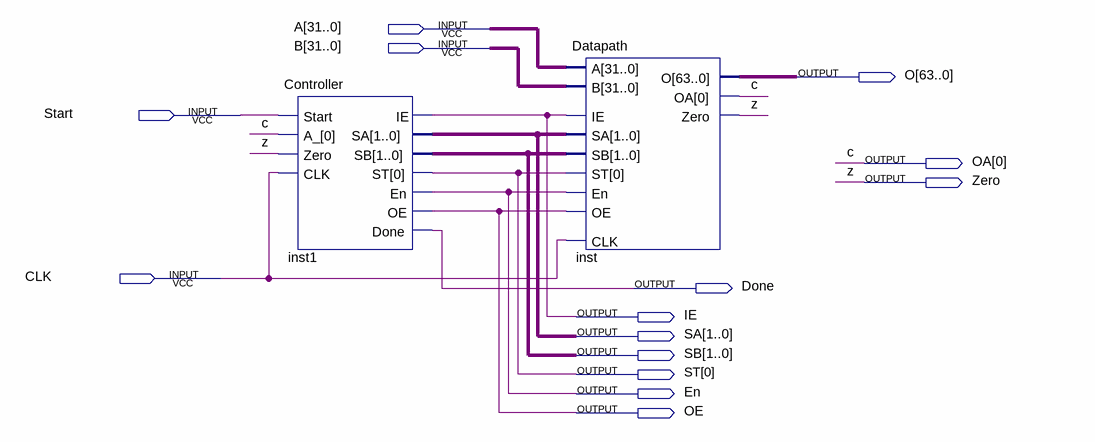
[diagram p0: schematic sheet]
// Quartus schematic VXL.bdf as structural Verilog: 2 symbols, 14 pins
module VXL (
  input  [31:0] A,
  input  [31:0] B,
  input  Start,
  input  CLK,
  output [63:0] O,
  output [0:0] OA,
  output Zero,
  output Done,
  output IE,
  output [1:0] SA,
  output [1:0] SB,
  output [0:0] ST,
  output En,
  output OE
);

  Controller inst1 (
    .Start(Start), .A_(OA[0]), .Zero(Zero), .CLK(CLK), .IE(IE), .SA(SA), .SB(SB), .ST(ST[0]), .En(En),
    .OE(OE), .Done(Done));
  Datapath inst (
    .ST(ST[0]), .OE(OE), .IE(IE), .SA(SA), .A(A), .SB(SB), .B(B), .CLK(CLK), .En(En), .O(O), .OA(OA[0]),
    .Zero(Zero));

  // Other names for the same wires on the sheet: c = OA[0]; z = Zero
endmodule
